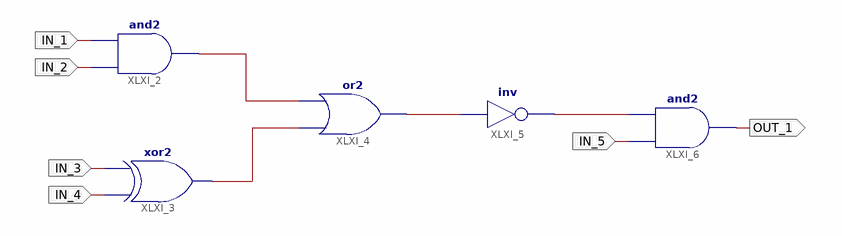
[diagram p0: schematic sheet 1]
// Xilinx ISE schematic noah.sch (spartan3e) as structural Verilog: 5 symbols, 6 ports
module noah (
  input  IN_1,
  input  IN_2,
  input  IN_3,
  input  IN_4,
  input  IN_5,
  output OUT_1
);

  wire XLXN_6, XLXN_7, XLXN_8, XLXN_9;

  and XLXI_2 (XLXN_6, IN_2, IN_1);
  xor XLXI_3 (XLXN_7, IN_4, IN_3);
  or XLXI_4 (XLXN_8, XLXN_7, XLXN_6);
  not XLXI_5 (XLXN_9, XLXN_8);
  and XLXI_6 (OUT_1, IN_5, XLXN_9);
endmodule
